# EAGLE design untitled (EAGLE 5.10)
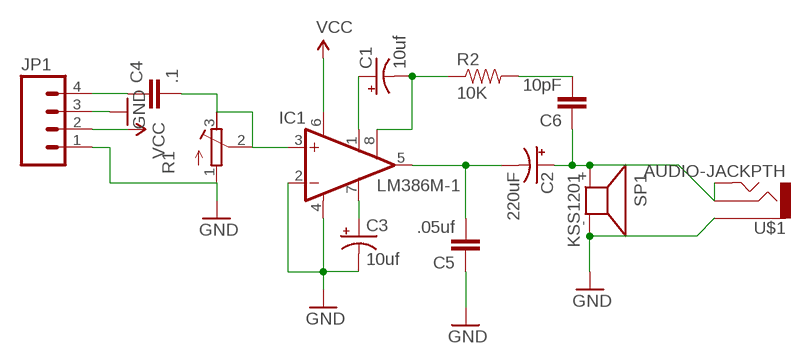
[diagram p0: schematic, sheet 1]

## Parts
C1  10uf  CAP_POL1206  [EIA3216]
C2  220uF  CAP_POLC  [PANASONIC_C]
C3  10uf  CAP_POL1206  [EIA3216]
C4  .1  CAP0805  [0805]
C5  .05uf  CAP0805  [0805]
C6  10pF  CAP0805  [0805]
IC1  LM386M-1  [SO08]
JP1  M04PTH  [1X04]
R1  R-TRIMM3103  [RTRIM3103]
R2  10K  RESISTOR  [0805]
SP1  KSS1201  [KSS1201]
U$1  AUDIO-JACKPTH  [AUDIO-JACK]

## Nets
GND: C3.C(-) C5.1 IC1.2(-IN) IC1.4(GND) JP1.1 JP1.3 R1.1(E) SP1.- U$1.1
N$1: C1.A(+) IC1.1(GAIN)
N$2: C1.C(-) IC1.8(GAIN) R2.1
N$3: C2.- C5.2 IC1.5(OUT)
N$5: C2.+ C6.1 SP1.+ U$1.2 U$1.5
N$6: C4.2 IC1.3(+IN) R1.2(S) R1.3(A)
N$8: C4.1 JP1.4
N$9: C3.A(+) IC1.7(BYPASS)
N$10: C6.2 R2.2
VCC: IC1.6(VS) JP1.2

## Library data of the parts
C1-C3 = SparkFun:CAP_POL: Capacitor Polarized These are standard SMD and PTH capacitors. Normally 10uF, 47uF, and 100uF in electrolytic and tantalum varieties. Always verify the external diameter of the through hole cap, it varies with capacity, voltage, and manufacturer. The EIA devices should be standard.
C4-C6 = SparkFun:CAP: Capacitor Standard 0603 ceramic capacitor, and 0.1" leaded capacitor.
IC1 = linear:LM386?-*: Low Voltage Audio Power Amplifier Source: http://cache.national.com/ds/LM/LM386.pdf
JP1 = SparkFun:M04: Header 4 Standard 4-pin 0.1" header. Use with straight break away headers (SKU : PRT-00116), right angle break away headers (PRT-00553), swiss pins (PRT-00743), machine pins (PRT-00117), and female headers (PRT-00115). Molex polarized connector foot print use with SKU : PRT-08231 with associated crimp pins and housings.
R1 = rcl:R-TRIMM: Trimm resistor
R2 = SparkFun:RESISTOR: Resistor Basic schematic elements and footprints for 0603, 1206, and PTH 1/10th watt (small) resistors.
SP1 = buzzer:KSS1201: SPEAKER Source: Schukat
U$1 = SparkFun:AUDIO-JACK: 3.5mm Audio Jack Simple 3.5mm common PCB mount audio jack. SKU: PRT-08032

## Board
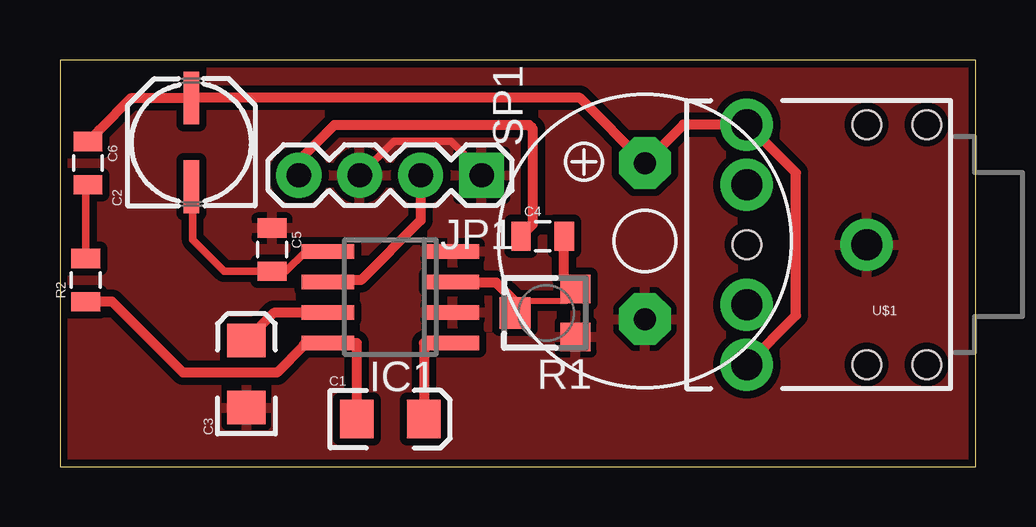
[diagram p1: board, top side]

Size 38.18 x 16.94 mm. Coordinates in mm from the lower left corner, seen from the top.
Outline: 0,0 38.18,0 38.18,16.94 0,16.94 0,0
Copper layers (1*16): Top 0.0356mm / dielectric 1.5011mm / Bottom 0.0356mm
Design rules "SparkFun-mod": minimum track width 8mil, minimum drill 20mil, track to track 12mil, track to pad 12mil, pad to pad 8mil, via to via 8mil, smd to smd 8mil, copper to edge 12mil, drill to drill 8mil, minimum pad ring 12mil, minimum via ring 10mil, stop-mask expansion 4mil, vias tented up to drill 25mil, thermal gap 10mil

### Footprints (pad centres in the part's own frame; a part is rotated, then mirrored left to right if it is on the bottom)
EIA3216 = smd 1.4 x 1.6: A 1.4,0; C -1.4,0
PANASONIC_C = smd 2.2 x 0.65: + 1.9,-0.2; - -1.8,-0.2
0805 = smd 0.8 x 1.2: 1 -0.9,0; 2 0.9,0
SO08 = smd 0.6 x 2.2: 1 -1.905,-2.6; 2 -0.635,-2.6; 3 0.635,-2.6; 4 1.905,-2.6; 5 1.905,2.6; 6 0.635,2.6; 7 -0.635,2.6; 8 -1.905,2.6
1X04 = drill 1.016 pad 1.88 square: 1 0,0 | drill 1.016 pad 1.88 round: 2 2.54,0; 3 5.08,0; 4 7.62,0
RTRIM3103 = smd 1.2 x 1.25: 1 -1,-1.225; 3 1,-1.225 | smd 1.3 x 1.3: 2 0,1.3
KSS1201 = drill 0.914 pad 2.159 octagon: + 3.251,0; - -3.251,0
AUDIO-JACK = drill 1.3 pad 2.184 round: 1 0,0; 2 5,5; 3 5,2.5; 4 5,-2.5; 5 5,-5 | hole 1.2: 0,5; -2.5,5; -2.5,-5; 0,-5; 5,0

### Placement (x,y rotation side)
C1  13.77,1.98 0 top
C2  5.28,13.46 90 top
C3  7.77,3.86 90 top
C4  20.12,9.6 0 top
C5  8.84,9.04 270 top
C6  1.17,12.65 270 top
IC1  13.77,7.06 90 top
JP1  17.58,12.14 180 top
R1  20.27,6.4 90 top
R2  1.07,7.77 90 top
SP1  24.38,9.4 90 top
U$1  33.63,9.25 180 top

### Tracks (layer width: path | path; a pad name or v marks a point on that pad's centre or on a via)
GND
  Top 0.305: JP1.3 13.92,13.56 16.31,13.56 17.58,12.29
  Top 0.406: JP1.1 17.58,12.29
  pour Top: -0.56,20.22 55.93,20.02 55.93,-3.66 -0.56,-3.45
N$1
  Top 0.406: IC1.1 15.17,5.16 C1.A
N$2
  Top 0.406: C1.C 12.37,5.16 IC1.8 10.24,5.16 10.16,5.08 10.16,5.03 9.04,3.91 5.13,3.91 2.17,6.87 R2.1
N$3
  Top 0.254: 5.54,10.67 5.54,11.61 C2.- 5.48,11.13 5.49,11.13
  Top 0.305: IC1.5 11.14,8.94 10.21,8.94 9.41,8.14 C5.2 6.84,8.14 5.54,9.45 5.54,10.67
N$5
  Top 0.406: U$1.2 30.68,6.3 30.68,12.24 28.68,14.25 U$1.5 25.98,14.25 SP1.+ 21.67,15.36 C2.+ 5.46,15.34 2.95,15.34 1.63,14.02 C6.1
N$6
  Top 0.254: 18.97,6.89 18.99,6.91 21.13,6.91 21.49,7.27 R1.3
  Top 0.406: C4.2 21.02,7.88 R1.3 | R1.2 18.97,6.89 18.19,7.67 16.39,7.67 IC1.3
N$8
  Top 0.406: JP1.4 9.96,12.75 11.43,14.22 19.56,14.22 19.71,14.07 19.71,10.09 C4.1
N$9
  Top 0.406: IC1.7 10.24,6.43 10.21,6.4 8.91,6.4 C3.A
N$10
  Top 0.305: R2.2 1.07,11.65 C6.2
VCC
  Top 0.406: JP1.2 15.04,10.26 12.55,7.77 11.24,7.77 IC1.6